# Altium schematic sheet RK3576-SMC.PMIC (0021.0 A0).SchDoc
size 420 x 297 mm; Scale: -; DocumentType: Схема электрическая принципиальная; DocumentGOSTLIt1: ㅤ; DocumentGOSTLIt2: ㅤ; DocumentGOSTLIt3: ㅤ; DocumentGOSTNote: Элементы, отмеченные *, используются при трассировке печатной платы, в состав модуля не включаются; SheetNumber: 4; SheetTotal: 6; DocumentTypeShort: Э3; DocumentInvertoryNumber: ㅤ
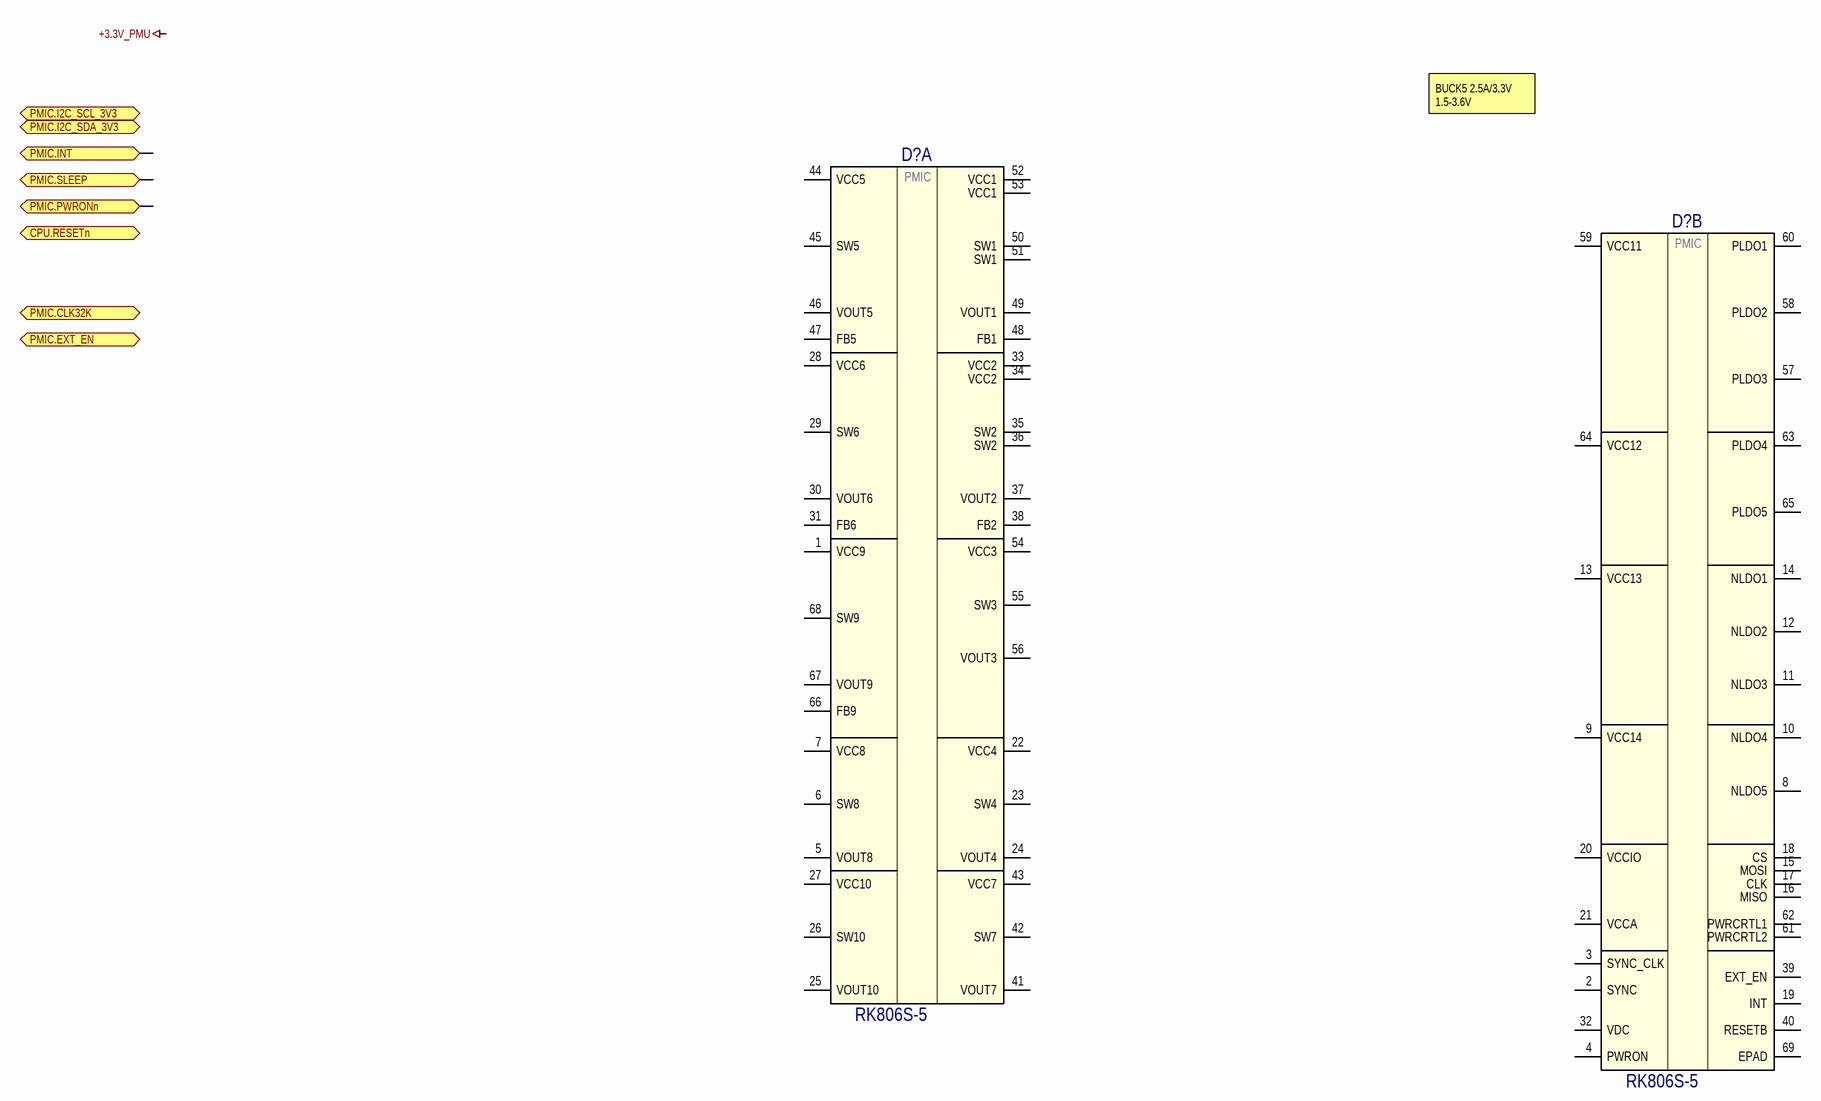
[diagram p0: RK3576-SMC.PMIC (0021.0 A0).SchDoc]

## Parts
(Parts that share a designator on the sheet are numbered #1, #2 ... from top to bottom, then left to right.)
D?#1  RK806S-5  [qfn35p700x700x90-69_hsn]  (part A of 2)
D?#2  RK806S-5  [qfn35p700x700x90-69_hsn]  (part B of 2)

## Ports
CPU.RESETn (bidir), PMIC.CLK32K (bidir), PMIC.EXT_EN (bidir), PMIC.I2C_SCL_3V3 (bidir), PMIC.I2C_SDA_3V3 (bidir), PMIC.INT (bidir), PMIC.PWRONn (bidir), PMIC.SLEEP (bidir)

## Nets

Not connected (* = marked no-connect by the designer): D?#1 1(VCC9) 5(VOUT8) 6(SW8) 7(VCC8) 22(VCC4) 23(SW4) 24(VOUT4) 25(VOUT10) 26(SW10) 27(VCC10) 28(VCC6) 29(SW6) 30(VOUT6) 31(FB6) 33(VCC2) 34(VCC2) 35(SW2) 36(SW2) 37(VOUT2) 38(FB2) 41(VOUT7) 42(SW7) 43(VCC7) 44(VCC5) 45(SW5) 46(VOUT5) 47(FB5) 48(FB1) 49(VOUT1) 50(SW1) 51(SW1) 52(VCC1) 53(VCC1) 54(VCC3) 55(SW3) 56(VOUT3) 66(FB9) 67(VOUT9) 68(SW9); D?#2 2(SYNC) 3(SYNC_CLK) 4(PWRON) 8(NLDO5) 9(VCC14) 10(NLDO4) 11(NLDO3) 12(NLDO2) 13(VCC13) 14(NLDO1) 15(MOSI) 16(MISO) 17(CLK) 18(CS) 19(INT) 20(VCCIO) 21(VCCA) 32(VDC) 39(EXT_EN) 40(RESETB) 57(PLDO3) 58(PLDO2) 59(VCC11) 60(PLDO1) 61(PWRCRTL2) 62(PWRCRTL1) 63(PLDO4) 64(VCC12) 65(PLDO5) 69(EPAD)

## Notes on the sheet
- BUCK5 2.5A/3.3V
  1.5-3.6V
- Labels drawn without touching a wire or pin: +3.3V_PMU
- Подп. и дата
- Инв. № дубл.
- Взам. инв. №
- Инв. № подл.
- Изм.
- Лист
- № докум.
- Подп.
- Дата
- Копировал
- Формат А3
- (in symbol RK806S-5, part A) PMIC
- (in symbol RK806S-5, part B) PMIC

## Library data of the parts
D?#1 D?#2 = RK806S-5: Power-management integrated circuit; Part_ID: ATB-08063; Manufacturer: Rockchip; Тип ЭКБ: Микросхемы; Тип компонента: Контроллеры; Voltage: 2.7 - 5.5; Температура: -40 +125; Тип корпуса: QFN7x7-68; Вариант установки: Поверхностный; Photo: Photos\Photos\Rockchip_RK806-1.jpg; Автор: Чепиков И.В.; Part Number: RK806S-5; Наименование: RK806S-5; Datasheet: Datasheets\Microcircuits\Rockchip_RK806S_Datasheet_V1.5.pdf; Schematic_Part: RK806-1; Value: RK806S-5; Part_Number: RK806S-5; PCB_Footprint: qfn35p700x700x90-69_hsn; Height: 0.9; Производитель: Rockchip; Дата: 16.09.2025; Device: RK806S-5; ComponentLink1Description: Rockchip_RK806S_Datasheet_V1.5.pdf; NameFromManufacturer: RK806S-5; Original PN: RK806S-5